# EasyEDA schematic Task_2021-06-01.json
TITLE: Sheet_1; REV: 1.0; Date: 2021-05-29; Sheet: 1/1; Company: Your Company
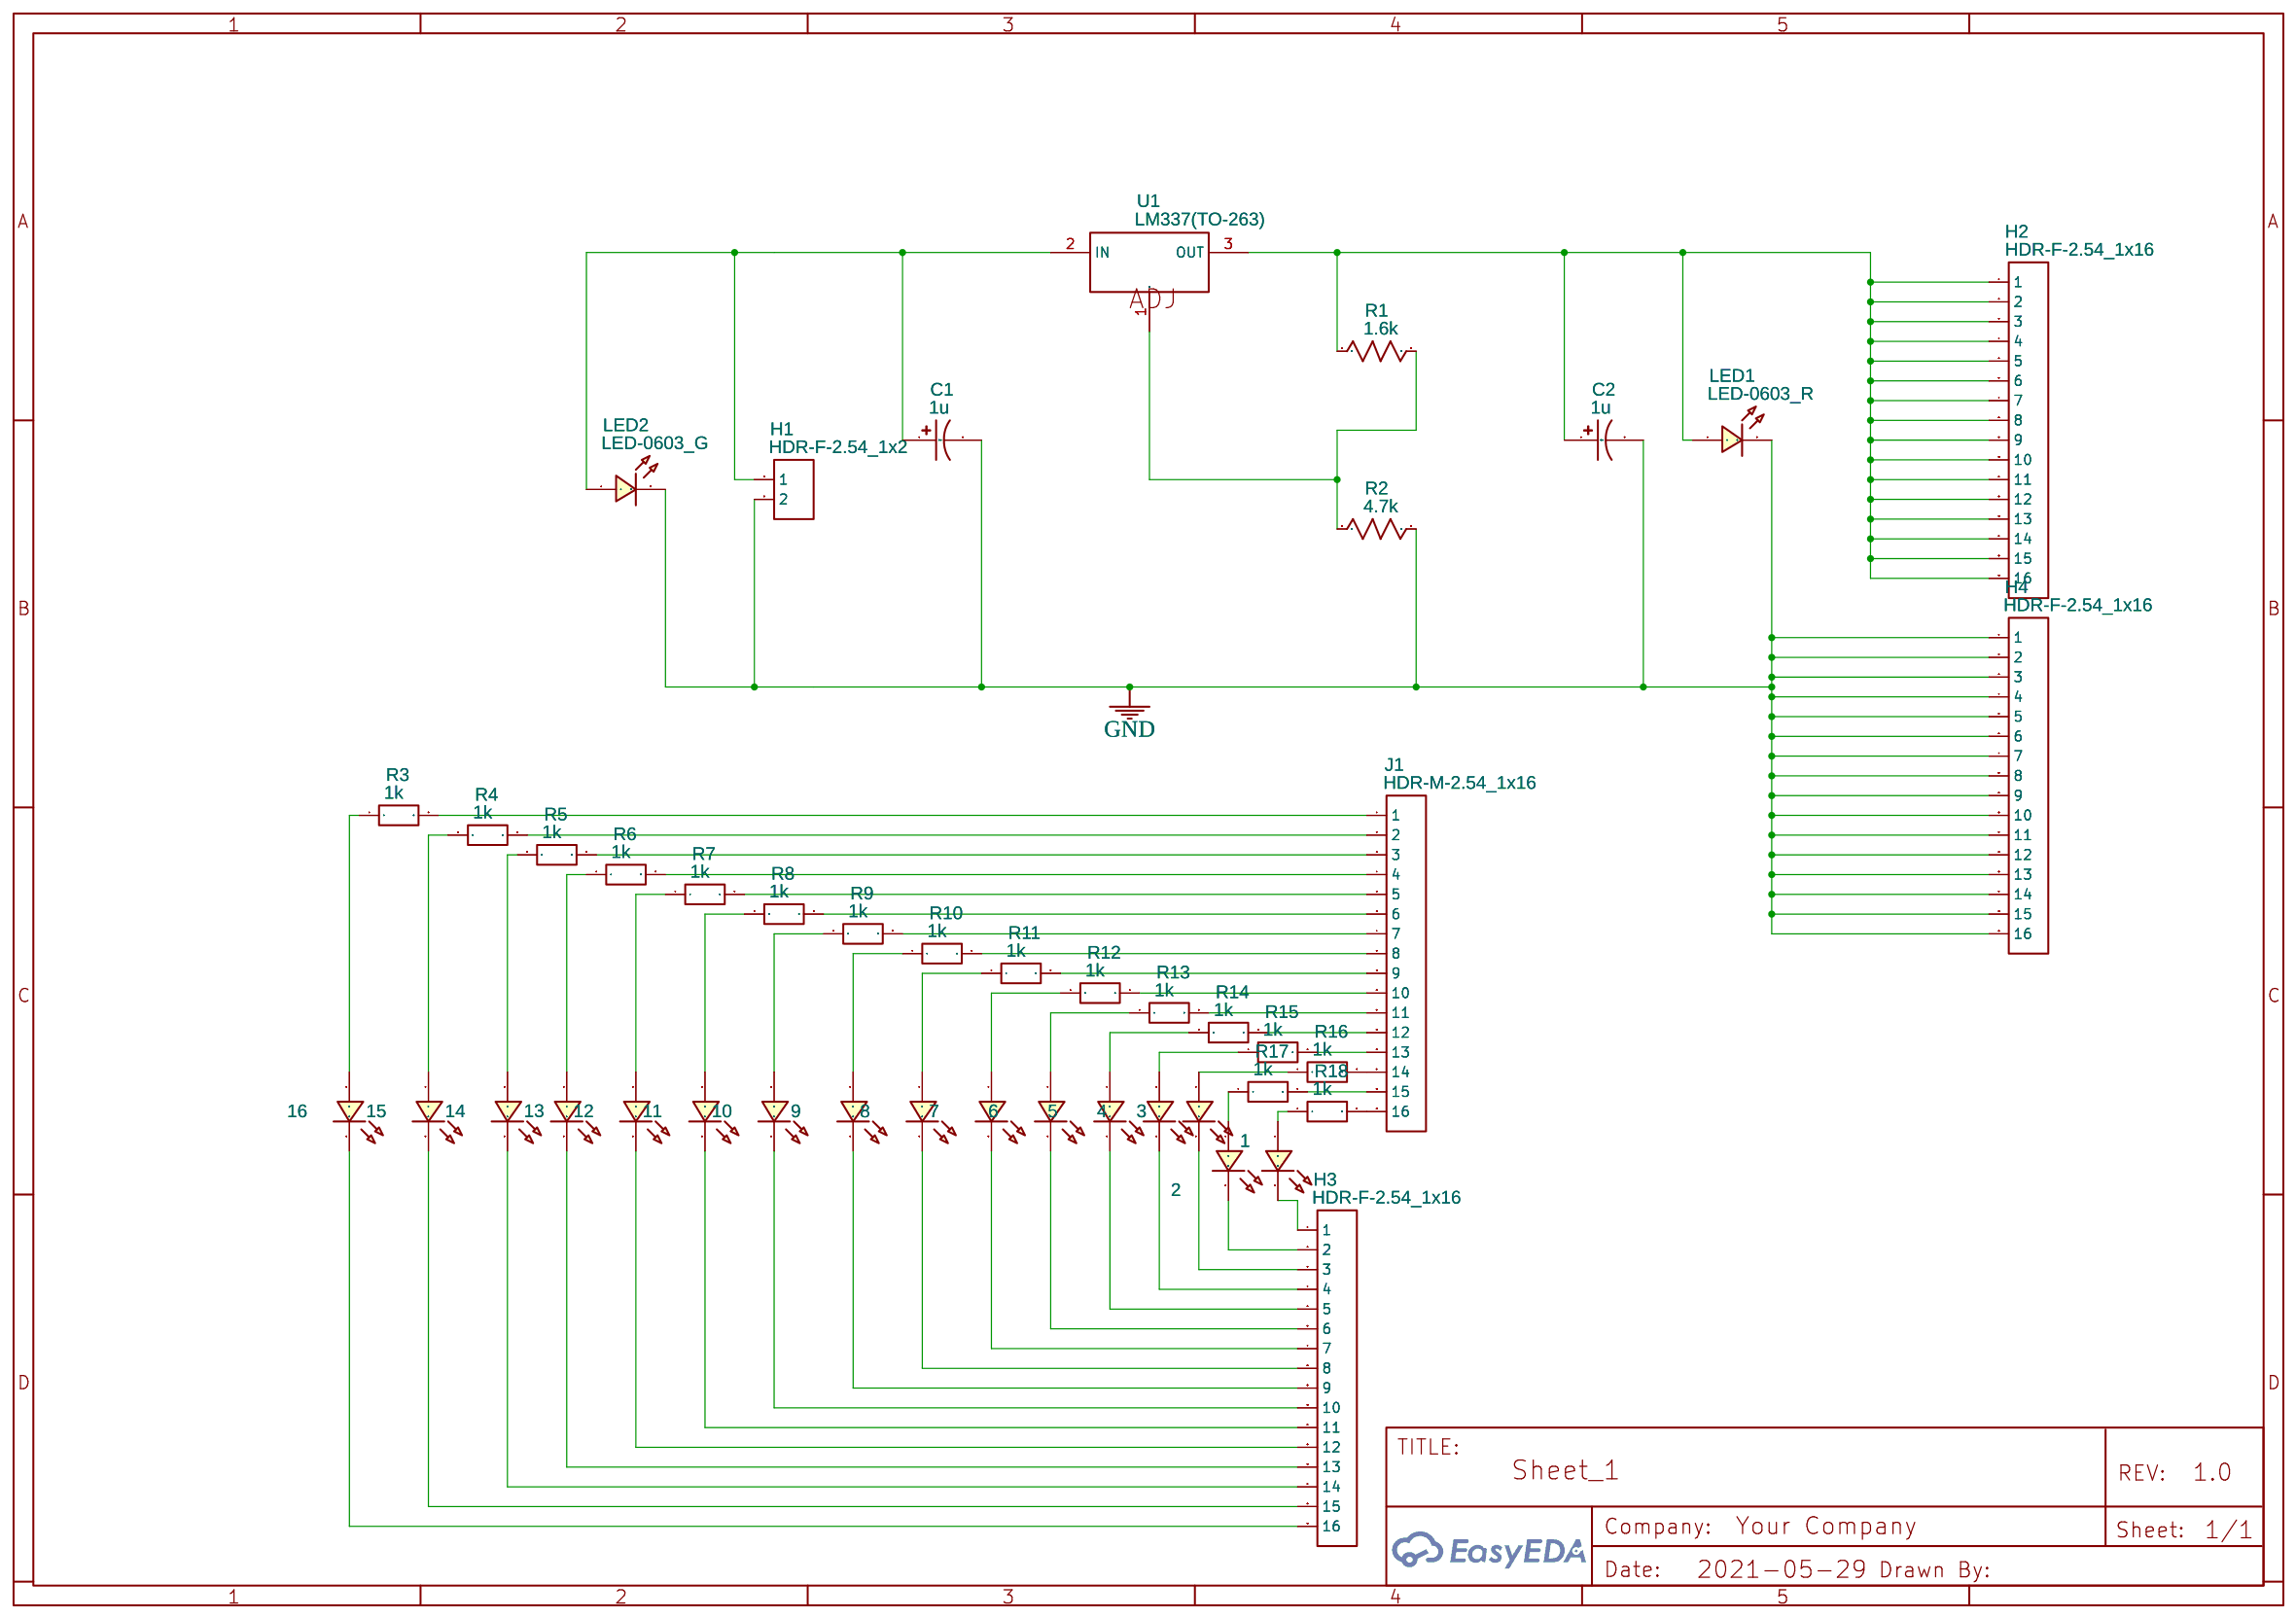
[diagram p0: schematic sheet]

## Parts
1  LED-TH-3mm_B  [LED-TH_BD3.0_BLUE]
2  LED-TH-3mm_B  [LED-TH_BD3.0_BLUE]
3  LED-TH-3mm_B  [LED-TH_BD3.0_BLUE]
4  LED-TH-3mm_B  [LED-TH_BD3.0_BLUE]
5  LED-TH-3mm_B  [LED-TH_BD3.0_BLUE]
6  LED-TH-3mm_B  [LED-TH_BD3.0_BLUE]
7  LED-TH-3mm_B  [LED-TH_BD3.0_BLUE]
8  LED-TH-3mm_B  [LED-TH_BD3.0_BLUE]
9  LED-TH-3mm_B  [LED-TH_BD3.0_BLUE]
10  LED-TH-3mm_B  [LED-TH_BD3.0_BLUE]
11  LED-TH-3mm_B  [LED-TH_BD3.0_BLUE]
12  LED-TH-3mm_B  [LED-TH_BD3.0_BLUE]
13  LED-TH-3mm_B  [LED-TH_BD3.0_BLUE]
14  LED-TH-3mm_B  [LED-TH_BD3.0_BLUE]
15  LED-TH-3mm_B  [LED-TH_BD3.0_BLUE]
16  LED-TH-3mm_B  [LED-TH_BD3.0_BLUE]
C1  1u  [CASE-A_3216]
C2  1u  [CASE-A_3216]
H1  HDR-F-2.54_1x2  [HDR-F-2.54_1X2]
H2  HDR-F-2.54_1x16  [HDR-F-2.54_1X16]
H3  HDR-F-2.54_1x16  [HDR-F-2.54_1X16]
H4  HDR-F-2.54_1x16  [HDR-F-2.54_1X16]
J1  HDR-M-2.54_1x16  [HDR-M-2.54_1X16]
LED1  LED-0603_R  [LED0603_RED]
LED2  LED-0603_G  [LED0603_GREEN]
R1  1.6k  [R0603]
R2  4.7k  [R0603]
R3  1k  [R0603]
R4  1k  [R0603]
R5  1k  [R0603]
R6  1k  [R0603]
R7  1k  [R0603]
R8  1k  [R0603]
R9  1k  [R0603]
R10  1k  [R0603]
R11  1k  [R0603]
R12  1k  [R0603]
R13  1k  [R0603]
R14  1k  [R0603]
R15  1k  [R0603]
R16  1k  [R0603]
R17  1k  [R0603]
R18  1k  [R0603]
U1  LM337(TO-263)  [TO-263-2_L10.1-W9.1-P5.08-LS15.2-BR]

## Library data of the parts
1-16 = LED-TH-3mm_B: Manufacturer: EVERLIGHT(台湾亿光); Manufacturer Part: 204-10SUBC/S400-A4; Supplier Part: C86881; Supplier: LCSC; Contributor: LCEDA_Lib
C1 C2 = C_Tan_SMD_A_US: Contributor: LCEDA_Lib
H1 = HDR-F-2.54_1x2: Supplier Part: C49661; Supplier: LCSC; Contributor: LCEDA_Lib
H2-H4 = HDR-F-2.54_1x16: Supplier Part: C66987; Supplier: LCSC; Contributor: LCEDA_Lib
J1 = HDR-M-2.54_1x16: Supplier Part: C50981; Supplier: LCSC; Contributor: LCEDA_Lib
LED1 = LED-0603_R: Manufacturer: EVERLIGHT(台湾亿光); Manufacturer Part: 19-217/R6C-AL1M2VY/3T; Supplier Part: C72044; Supplier: LCSC; Contributor: LCEDA_01
LED2 = LED-0603_G: Manufacturer: EVERLIGHT(台湾亿光); Manufacturer Part: 19-217/GHC-YR1S2/3T; Supplier Part: C72043; Supplier: LCSC; Contributor: LCEDA_Lib
R1 R2 = R_0603_US: Contributor: LCEDA_Lib
R3-R18 = R_0603_EU: Contributor: LCEDA_Lib
U1 = LM337(TO-263): Supplier: LCSC; Manufacturer: ON; Manufacturer Part: LM337D2TG; Contributor: LCEDA_Lib; Supplier Part: C146782

## Nets
GND: C1.2 C2.2 H1.2 H4.1 H4.2 H4.3 H4.4 H4.5 H4.6 H4.7 H4.8 H4.9 H4.10 H4.11 H4.12 H4.13 H4.14 H4.15 H4.16 LED1.2 LED2.2 R2.2
Net-(1-1): 1.1 R18.1
Net-(1-2): 1.2 H3.1
Net-(2-1): 2.1 R17.1
Net-(2-2): 2.2 H3.2
Net-(3-1): 3.1 R16.1
Net-(3-2): 3.2 H3.3
Net-(4-1): 4.1 R15.1
Net-(4-2): 4.2 H3.4
Net-(5-1): 5.1 R14.1
Net-(5-2): 5.2 H3.5
Net-(6-1): 6.1 R13.1
Net-(6-2): 6.2 H3.6
Net-(7-1): 7.1 R12.1
Net-(7-2): 7.2 H3.7
Net-(8-1): 8.1 R11.1
Net-(8-2): 8.2 H3.8
Net-(9-1): 9.1 R10.1
Net-(9-2): 9.2 H3.9
Net-(10-1): 10.1 R9.1
Net-(10-2): 10.2 H3.10
Net-(11-1): 11.1 R8.1
Net-(11-2): 11.2 H3.11
Net-(12-1): 12.1 R7.1
Net-(12-2): 12.2 H3.12
Net-(13-1): 13.1 R6.1
Net-(13-2): 13.2 H3.13
Net-(14-1): 14.1 R5.1
Net-(14-2): 14.2 H3.14
Net-(15-1): 15.1 R4.1
Net-(15-2): 15.2 H3.15
Net-(16-1): 16.1 R3.1
Net-(16-2): 16.2 H3.16
Net-(C1-1): C1.1 H1.1 LED2.1 U1.2(IN)
Net-(C2-1): C2.1 H2.1 H2.2 H2.3 H2.4 H2.5 H2.6 H2.7 H2.8 H2.9 H2.10 H2.11 H2.12 H2.13 H2.14 H2.15 H2.16 LED1.1 R1.1 U1.3(OUT)
Net-(J1-1): J1.1 R3.2
Net-(J1-2): J1.2 R4.2
Net-(J1-3): J1.3 R5.2
Net-(J1-4): J1.4 R6.2
Net-(J1-5): J1.5 R7.2
Net-(J1-6): J1.6 R8.2
Net-(J1-7): J1.7 R9.2
Net-(J1-8): J1.8 R10.2
Net-(J1-9): J1.9 R11.2
Net-(J1-10): J1.10 R12.2
Net-(J1-11): J1.11 R13.2
Net-(J1-12): J1.12 R14.2
Net-(J1-13): J1.13 R15.2
Net-(J1-14): J1.14 R16.2
Net-(J1-15): J1.15 R17.2
Net-(J1-16): J1.16 R18.2
Net-(R1-2): R1.2 R2.1 U1.1(ADJ)
